# Altium schematic sheet Chess Clock Touch Panel.SchDoc
size A4; SheetNumber: 1; SheetTotal: 1
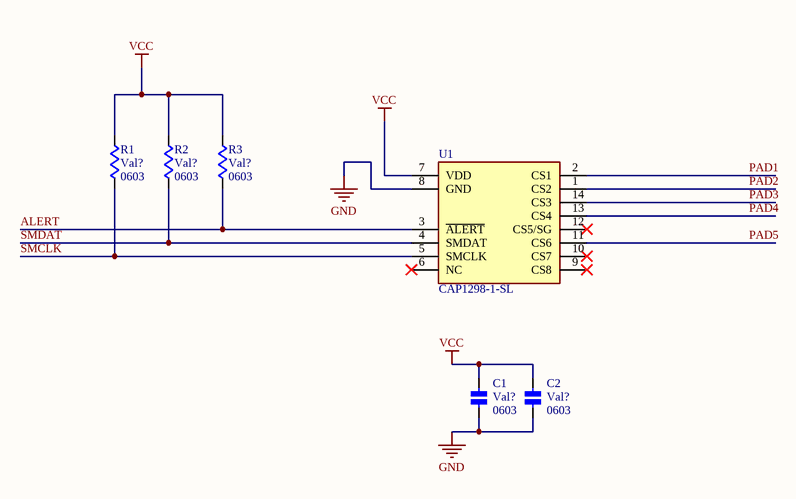
[diagram p0: Chess Clock Touch Panel.SchDoc]

## Parts
C1  Package: 0603  [CAPC0603X08N]  (hidden comment: Val?)
C2  Package: 0603  [CAPC0603X08N]  (hidden comment: Val?)
R1  Package: 0603  [RESC0603X04N]  (hidden comment: Val?)
R2  Package: 0603  [RESC0603X04N]  (hidden comment: Val?)
R3  Package: 0603  [RESC0603X04N]  (hidden comment: Val?)
U1  CAP1298-1-SL  [CAP1298-1-SL]

## Nets
GND: C1.2 C2.2 U1.8(GND)
VCC: C1.1 C2.1 R1.2 R2.2 R3.2 U1.7(VDD)
ALERT: R3.1 U1.3(~{ALERT})
PAD1: U1.2(CS1)
PAD2: U1.1(CS2)
PAD3: U1.14(CS3)
PAD4: U1.13(CS4)
PAD5: U1.11(CS6)
SMCLK: R1.1 U1.5(SMCLK)
SMDAT: R2.1 U1.4(SMDAT)

Not connected (* = marked no-connect by the designer): U1 6(NC)* 9(CS8)* 10(CS7)* 12(CS5/SG)*

## Library data of the parts
C1 C2 = GENERIC CAPC 0603: Categories: Ceramic Capacitors; Manufacturer: -; Manufacturer Part Number: -; Temperature Coefficient: -; Tolerance: -; Supplier 1: Digi-Key; Supplier Part Number 1: -; Supplier 2: LCSC; Supplier Part Number 2: -; Voltage - Rated: -; Capacitance: Val?
R1-R3 = GENERIC RESC 0603: Categories: Resistors; Manufacturer: -; Manufacturer Part Number: -; Supplier 1: Digi-Key; Supplier Part Number 1: -; Temperature Coefficient: -; Tolerance: -; Power (Watts): -; Resistance: Val?
U1 = CAP1298-1-SL: 8-CHANNEL CAPACITIVE TOUCH SENSO; Manufacturer: Microchip Technology; Categories: Interface ICs; Manufacturer Part Number: CAP1298-1-SL; Package: 14-SOIC; Supplier 1: Digi-Key; Supplier Part Number 1: CAP1298-1-SL-ND; Supplier 2: LCSC; Supplier Part Number 2: C1522287; Note: *